# Altium project PCB_Project.PrjPcb
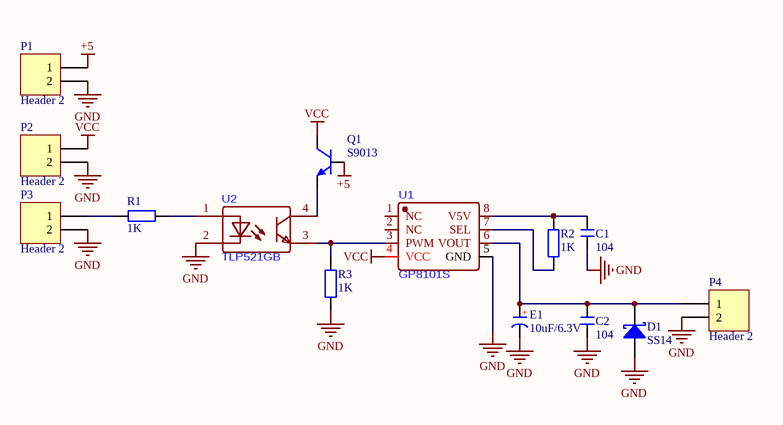
[diagram p0: Sheet1.SchDoc]
1 sheet, 14 parts. Net scope: global (net labels, ports and power ports of the same name join across sheets).
Board file: PCB1.PcbDoc

## Sheet Sheet1.SchDoc
size A4; SheetNumber: 1; SheetTotal: 1

### Parts
C1  104  [C 0805_L]
C2  104  [C 0805_L]
D1  SS14  [SMA]
E1  10uF/6.3V  [CS 2.0*5*8 - C]
P1  Header 2  [HDR1X2]
P2  Header 2  [HDR1X2]
P3  Header 2  [HDR1X2]
P4  Header 2  [HDR1X2]
Q1  S9013  [TO92A]
R1  1K  [R 0805_L]
R2  1K  [R 0805_L]
R3  1K  [R 0805_L]
U1  GP8101S  [SOIC-8_L4.9-W3.9-P1.27-LS6.0-TR]
U2  TLP521GB  [DIP-4_L6.4-W4.6-P2.54-LS7.6-BL]

### Nets
+5: P1.1 Q1.2(B)
GND: C1.1 C2.1 D1.1(A) E1.2(K) P1.2 P2.2 P3.2 P4.2 R3.1 U1.5(GND) U2.2
VCC: P2.1 Q1.3(C) U1.4(VCC)
NetC1_2: C1.2 R2.2 U1.8(V5V)
NetC2_2: C2.2 D1.2(K) E1.1(A) P4.1 U1.6(VOUT)
NetP3_1: P3.1 R1.1
NetQ1_1: Q1.1(E) U2.4
NetR1_2: R1.2 U2.1
NetR2_1: R2.1 U1.7(SEL)
NetR3_2: R3.2 U1.3(PWM) U2.3

Not connected (* = marked no-connect by the designer): U1 1(NC) 2(NC)

### Notes on the sheet
- (in symbol CS) +

### Library data of the parts
C1 C2 = C: 贴片电容; 淘宝ID: 小糖豆的小窝窝; BOM名称: 贴片电容; 下单链接: https://item.taobao.com/item.htm?ft=t&id=613637044352
D1 = SS14: 肖特基二极管; 淘宝ID: 小糖豆的小窝窝; BOM名称: 肖特基二极管; 下单链接: https://item.taobao.com/item.htm?ft=t&id=613637044352
E1 = CS: 直插固态电容; 淘宝ID: 小糖豆的小窝窝; BOM名称: 直插固态电容; 下单链接: https://item.taobao.com/item.htm?ft=t&id=613637044352
P1-P4 = Header 2: Header, 2-Pin; LatestRevisionDate: 17-Jul-2002; LatestRevisionNote: Re-released for DXP Platform.; Publisher: Altium Limited
Q1 = 9013-DIP: 低频放大-NPN型; 淘宝ID: 小糖豆的小窝窝; BOM名称: 低频放大-NPN型; 下单链接: https://item.taobao.com/item.htm?ft=t&id=613637044352
R1-R3 = R: 贴片电阻; 淘宝ID: 小糖豆的小窝窝; BOM名称: 贴片电阻; 下单链接: https://item.taobao.com/item.htm?ft=t&id=613637044352